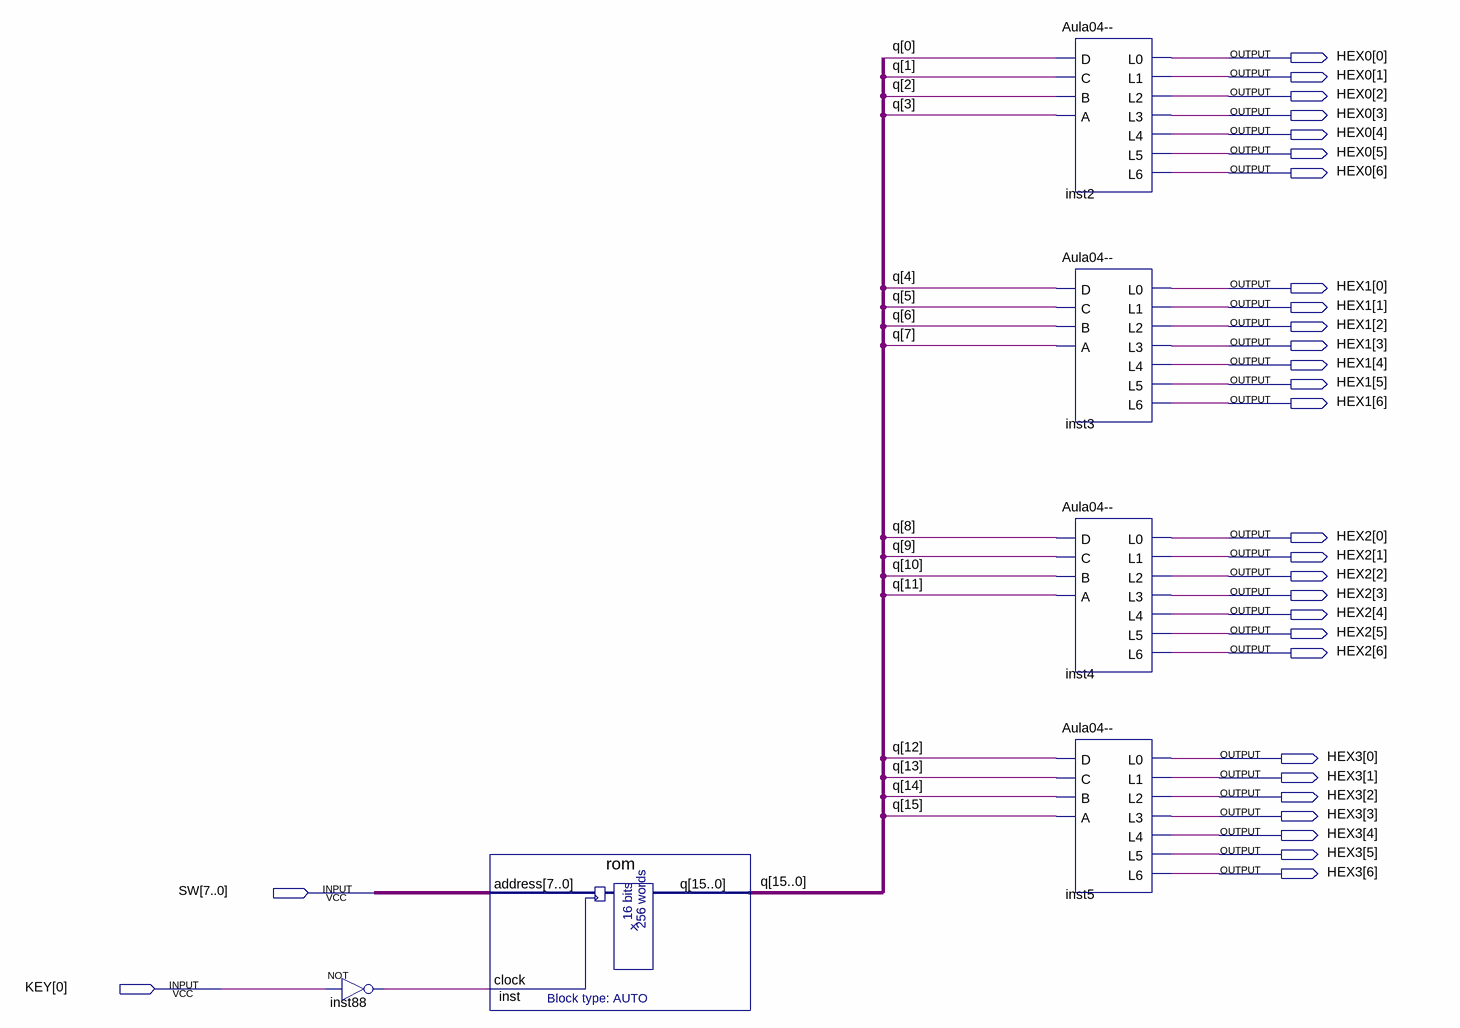
[diagram p0: schematic sheet]
// Quartus schematic ROM.bdf as structural Verilog: 6 symbols, 30 pins
module ROM (
  input  [7:0] SW,
  input  [0:0] KEY,
  output [6:0] HEX0,
  output [6:0] HEX1,
  output [6:0] HEX2,
  output [6:0] HEX3
);

  wire inst88_out;
  wire [15:0] q;

  not inst88 (inst88_out, KEY[0]);
  rom inst (.address(SW), .clock(inst88_out), .q(q));
  \Aula04--  inst2 (
    .D(q[0]), .C(q[1]), .B(q[2]), .A(q[3]), .L0(HEX0[0]), .L1(HEX0[1]), .L2(HEX0[2]), .L3(HEX0[3]),
    .L4(HEX0[4]), .L5(HEX0[5]), .L6(HEX0[6]));
  \Aula04--  inst3 (
    .D(q[4]), .C(q[5]), .B(q[6]), .A(q[7]), .L0(HEX1[0]), .L1(HEX1[1]), .L2(HEX1[2]), .L3(HEX1[3]),
    .L4(HEX1[4]), .L5(HEX1[5]), .L6(HEX1[6]));
  \Aula04--  inst4 (
    .D(q[8]), .C(q[9]), .B(q[10]), .A(q[11]), .L0(HEX2[0]), .L1(HEX2[1]), .L2(HEX2[2]), .L3(HEX2[3]),
    .L4(HEX2[4]), .L5(HEX2[5]), .L6(HEX2[6]));
  \Aula04--  inst5 (
    .D(q[12]), .C(q[13]), .B(q[14]), .A(q[15]), .L0(HEX3[0]), .L1(HEX3[1]), .L2(HEX3[2]), .L3(HEX3[3]),
    .L4(HEX3[4]), .L5(HEX3[5]), .L6(HEX3[6]));
endmodule
